# Altium schematic sheet connector.SchDoc
size A4; SheetNumber: 3; SheetTotal: 4
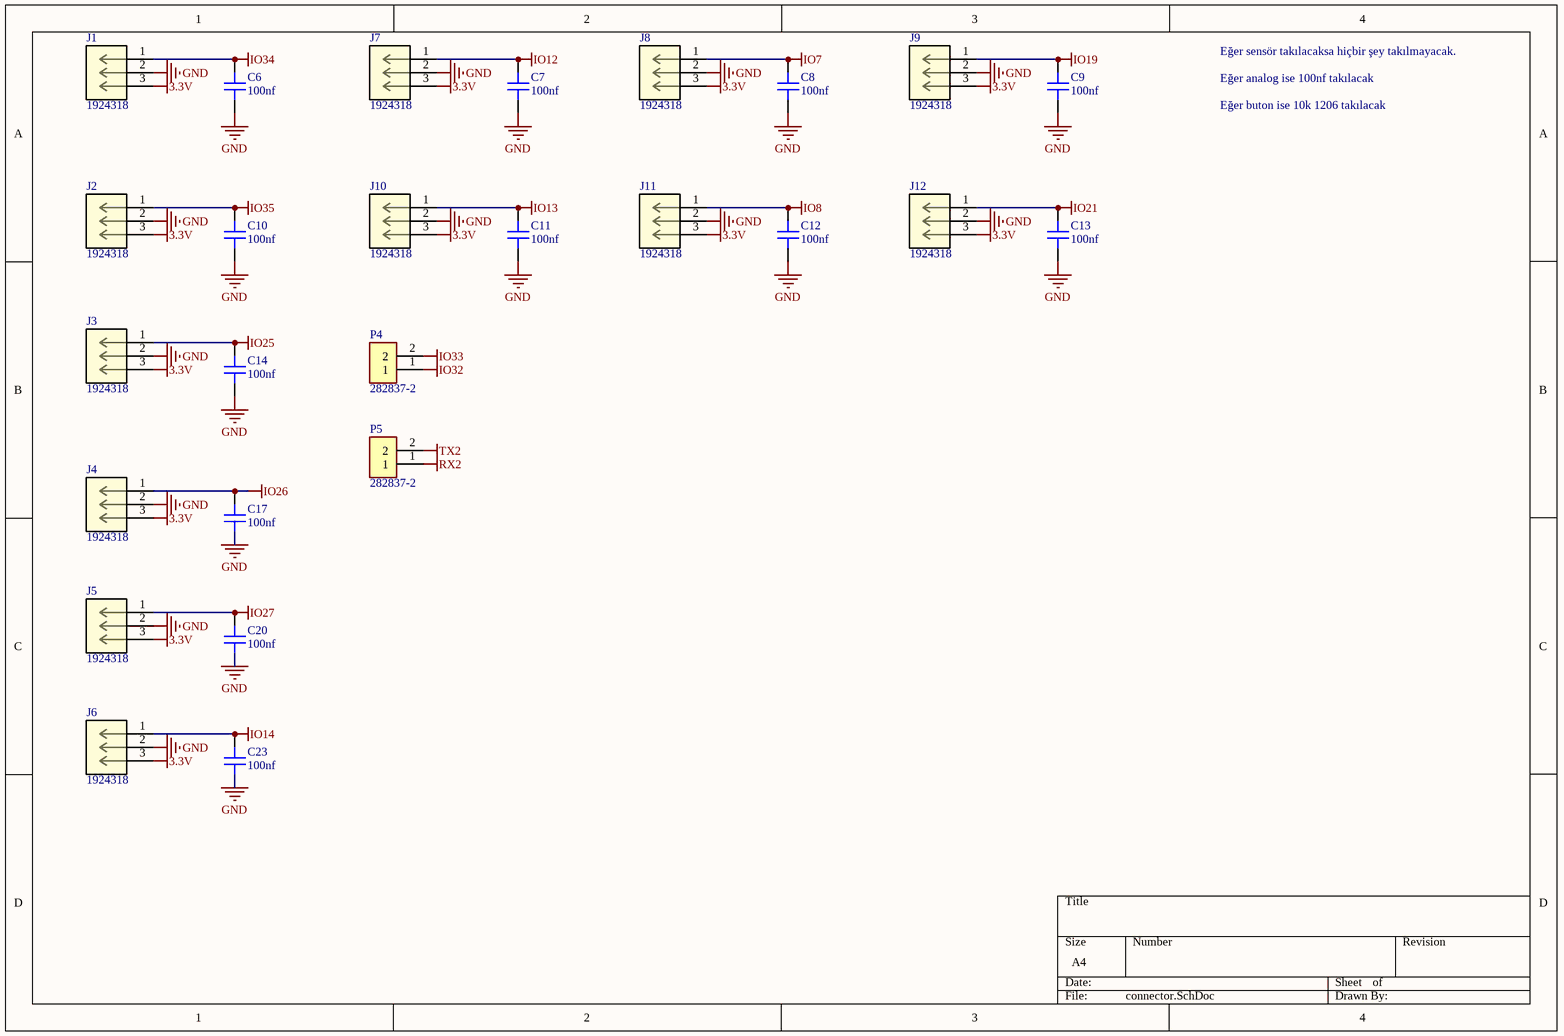
[diagram p0: connector.SchDoc]

## Parts
C6  100nf  [CAP 1206_3216 - 0.8MM]
C7  100nf  [CAP 1206_3216 - 0.8MM]
C8  100nf  [CAP 1206_3216 - 0.8MM]
C9  100nf  [CAP 1206_3216 - 0.8MM]
C10  100nf  [CAP 1206_3216 - 0.8MM]
C11  100nf  [CAP 1206_3216 - 0.8MM]
C12  100nf  [CAP 1206_3216 - 0.8MM]
C13  100nf  [CAP 1206_3216 - 0.8MM]
C14  100nf  [CAP 1206_3216 - 0.8MM]
C17  100nf  [CAP 1206_3216 - 0.8MM]
C20  100nf  [CAP 1206_3216 - 0.8MM]
C23  100nf  [CAP 1206_3216 - 0.8MM]
J1  1924318  [CONN_1924318]
J2  1924318  [CONN_1924318]
J3  1924318  [CONN_1924318]
J4  1924318  [CONN_1924318]
J5  1924318  [CONN_1924318]
J6  1924318  [CONN_1924318]
J7  1924318  [CONN_1924318]
J8  1924318  [CONN_1924318]
J9  1924318  [CONN_1924318]
J10  1924318  [CONN_1924318]
J11  1924318  [CONN_1924318]
J12  1924318  [CONN_1924318]
P4  282837-2  [TE_282837-2]
P5  282837-2  [TE_282837-2]

## Nets
3.3V: J1.3 J2.3 J3.3 J4.3 J5.3 J6.3 J7.3 J8.3 J9.3 J10.3 J11.3 J12.3
GND: C6.1 C7.1 C8.1 C9.1 C10.1 C11.1 C12.1 C13.1 C14.1 C17.1 C20.1 C23.1 J1.2 J2.2 J3.2 J4.2 J5.2 J6.2 J7.2 J8.2 J9.2 J10.2 J11.2 J12.2
IO7: C8.2 J8.1
IO8: C12.2 J11.1
IO12: C7.2 J7.1
IO13: C11.2 J10.1
IO14: C23.2 J6.1
IO19: C9.2 J9.1
IO21: C13.2 J12.1
IO25: C14.2 J3.1
IO26: C17.2 J4.1
IO27: C20.2 J5.1
IO32: P4.1
IO33: P4.2
IO34: C6.2 J1.1
IO35: C10.2 J2.1
RX2: P5.1
TX2: P5.2

## Notes on the sheet
- Eğer sensör takılacaksa hiçbir şey takılmayacak.
- Eğer analog ise 100nf takılacak
- Eğer buton ise 10k 1206 takılacak

## Library data of the parts
C6-C14 C17 C20 C23 = MM062C102KCZ2A: CAP CER 1000PF 200V X7R 1206; manufacturer: AVX Corporation; Tolerance: ±10%; Part Number: MM062C102KCZ2A; Value: 1000pF; Applications: Medical, Non-Critical; Capacitance: 1000pF; componentlink1description: Datasheet; componentlink1url: http://datasheets.avx.com/AVX-MM.pdf; componentlink2description: DigiKey Link; componentlink2url: http://digikey.com/product-detail/en/avx-corporation/MM062C102KCZ2A/478-10625-1-ND/7344886; Device Package: 1206 (3216 Metric); lastupdated: 2.09.2020 01:04:46; Lifecycle Status: Active; Minimum Order: 1; Mounting Type: Surface Mount, MLCC; Operating Temperature: -55°C ~ 125°C; Package / Case: 1206 (3216 Metric); packaging: TapeAndReel; partid: 18686; Part Status: Active; price: 0.57; series: MM; Size / Dimension: 0.126" L x 0.063" W (3.20mm x 1.60mm); Supplier 1: DigiKey; Supplier Part Number 1: 478-10625-1-ND; Temperature Coefficient: X7R; Thickness (Max): 0.029" (0.74mm); Voltage - Rated: 200V
J1-J12 = 1924318: No Description Available; Mfr_Name: Phoenix Contact; RefDes: RefDes; Type: Type
P4 P5 = 282837-2: Ð Ð°Ð·ÑŠÐµÐ¼Ð½Ñ‹Ðµ ÐºÐ»ÐµÐ¼Ð¼Ð½Ñ‹Ðµ ÐºÐ¾Ð»Ð¾Ð´ÐºÐ¸ Ð Ð¾Ð·ÐµÑ‚ÐºÐ° 2 Ð¿Ð¾Ð»Ð¾Ð¶ÐµÐ½Ð¸Ñ 5,08 Ð¼Ð¼ ÐŸÑ€Ð¸Ð¿Ð¾Ð¹ Ð¿Ñ€ÑÐ¼Ð¾Ð¹ Ñ‡ÐµÑ€ÐµÐ· Ð¾Ñ‚Ð²ÐµÑ€ÑÑ‚Ð¸Ðµ 13,5 Ð / ÐºÐ¾Ð½Ñ‚Ð°ÐºÑ‚; MF: TE Connectivity; SnapEDA_Link: https://www.snapeda.com/parts/282837-2/TE+Connectivity+AMP+Connectors/view-part/?ref=snap; Price: None; Check_prices: https://www.snapeda.com/parts/282837-2/TE+Connectivity+AMP+Connectors/view-part/?ref=eda; Purchase-URL: https://pricing.snapeda.com/search/part/282837-2/?ref=eda; MP: 282837-2; Value: *; Availability: In Stock; Package: None